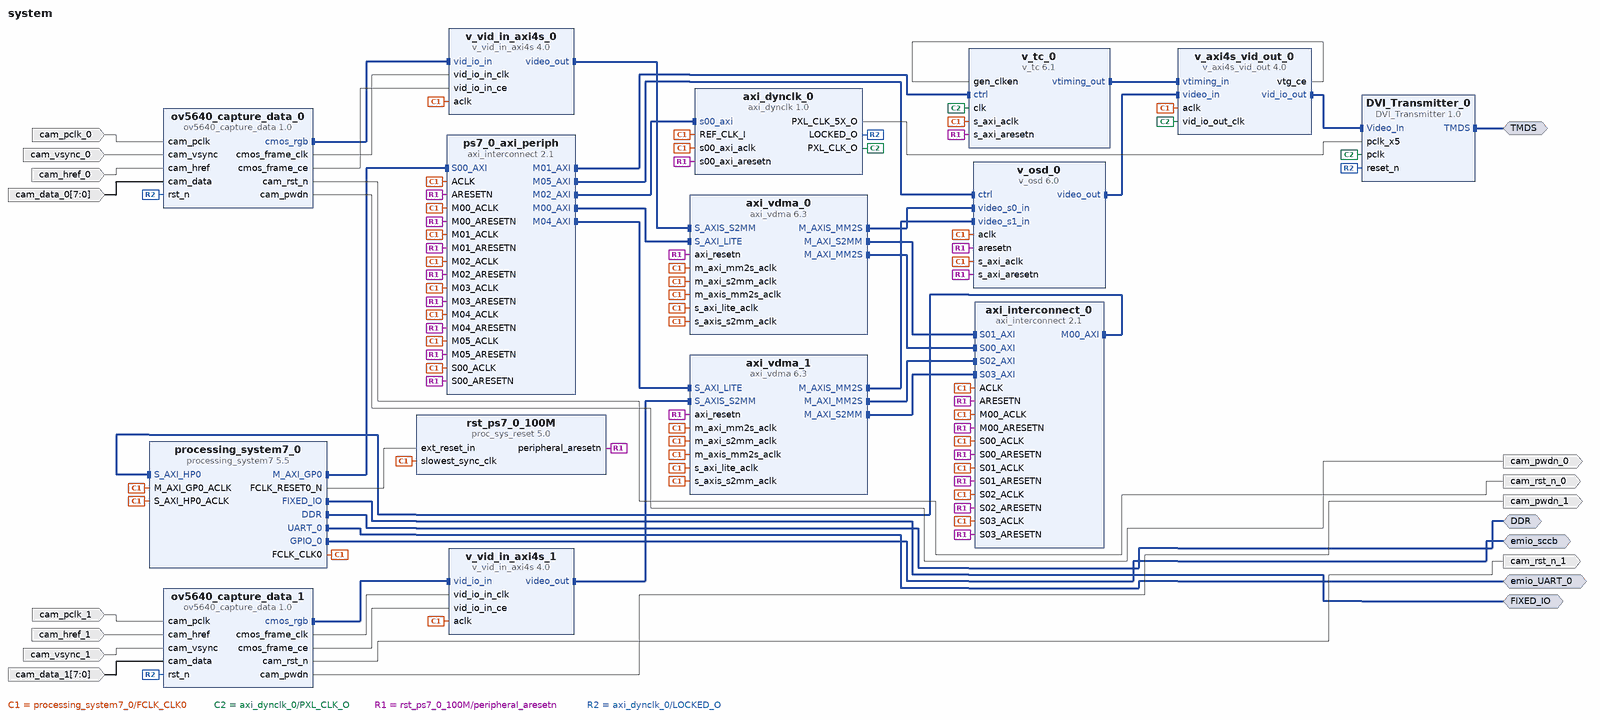
[diagram p0: block diagram of the top level]
# Vivado block design system, xc7z020clg400-2, Vivado 2018.3
create_bd_design system

create_bd_intf_port -mode Master -vlnv xilinx.com:interface:ddrx_rtl:1.0 DDR
create_bd_intf_port -mode Master -vlnv xilinx.com:display_processing_system7:fixedio_rtl:1.0 FIXED_IO
create_bd_intf_port -mode Master -vlnv xilinx.com:interface:gpio_rtl:1.0 emio_sccb
create_bd_intf_port -mode Master -vlnv openedv.com:user:TMDS_rtl:1.0 TMDS
create_bd_intf_port -mode Master -vlnv xilinx.com:interface:uart_rtl:1.0 emio_UART_0
create_bd_port -dir I cam_pclk_0
create_bd_port -dir I cam_vsync_0
create_bd_port -dir I cam_href_0
create_bd_port -dir I -from 7 -to 0 cam_data_0
create_bd_port -dir O -type rst cam_rst_n_0
create_bd_port -dir O cam_pwdn_0
create_bd_port -dir I cam_pclk_1
create_bd_port -dir I cam_href_1
create_bd_port -dir I cam_vsync_1
create_bd_port -dir I -from 7 -to 0 cam_data_1
create_bd_port -dir O -type rst cam_rst_n_1
create_bd_port -dir O cam_pwdn_1

create_bd_cell -type ip -vlnv xilinx.com:ip:processing_system7:5.5 processing_system7_0
set_property -dict [list \
  CONFIG.PCW_FPGA0_PERIPHERAL_FREQMHZ 100 \
  CONFIG.PCW_GPIO_EMIO_GPIO_ENABLE 1 \
  CONFIG.PCW_GPIO_EMIO_GPIO_IO 4 \
  CONFIG.PCW_GPIO_EMIO_GPIO_WIDTH 4 \
  CONFIG.PCW_PRESET_BANK1_VOLTAGE {LVCMOS 1.8V} \
  CONFIG.PCW_QSPI_GRP_SINGLE_SS_ENABLE 1 \
  CONFIG.PCW_QSPI_GRP_SINGLE_SS_IO {MIO 1 .. 6} \
  CONFIG.PCW_QSPI_PERIPHERAL_ENABLE 1 \
  CONFIG.PCW_QSPI_QSPI_IO {MIO 1 .. 6} \
  CONFIG.PCW_SD0_GRP_CD_ENABLE 1 \
  CONFIG.PCW_SD0_GRP_CD_IO {MIO 10} \
  CONFIG.PCW_SD0_GRP_WP_ENABLE 0 \
  CONFIG.PCW_SD0_PERIPHERAL_ENABLE 1 \
  CONFIG.PCW_SD0_SD0_IO {MIO 40 .. 45} \
  CONFIG.PCW_SDIO_PERIPHERAL_FREQMHZ 100 \
  CONFIG.PCW_SINGLE_QSPI_DATA_MODE x4 \
  CONFIG.PCW_UART0_PERIPHERAL_ENABLE 1 \
  CONFIG.PCW_UART0_UART0_IO EMIO \
  CONFIG.PCW_UART_PERIPHERAL_FREQMHZ 100 \
  CONFIG.PCW_UIPARAM_DDR_PARTNO {MT41J256M16 RE-125} \
  CONFIG.PCW_USE_S_AXI_HP0 1 \
] [get_bd_cells processing_system7_0]
# 86 more settings of processing_system7_0 are not shown: defaults, MIO pin electricals, DDR timing, and values the tool derives
create_bd_cell -type ip -vlnv xilinx.com:ip:axi_vdma:6.3 axi_vdma_0
set_property -dict [list \
  CONFIG.c_include_s2mm 1 \
  CONFIG.c_m_axis_mm2s_tdata_width 24 \
  CONFIG.c_mm2s_linebuffer_depth 2048 \
  CONFIG.c_mm2s_max_burst_length 64 \
  CONFIG.c_num_fstores 3 \
  CONFIG.c_s2mm_genlock_mode 2 \
  CONFIG.c_s2mm_linebuffer_depth 2048 \
  CONFIG.c_s2mm_max_burst_length 64 \
] [get_bd_cells axi_vdma_0]
create_bd_cell -type ip -vlnv xilinx.com:ip:v_tc:6.1 v_tc_0
set_property -dict {CONFIG.enable_detection false} [get_bd_cells v_tc_0]
create_bd_cell -type ip -vlnv xilinx.com:ip:v_axi4s_vid_out:4.0 v_axi4s_vid_out_0
set_property -dict {CONFIG.C_HAS_ASYNC_CLK 1} [get_bd_cells v_axi4s_vid_out_0]
create_bd_cell -type ip -vlnv digilentinc.com:ip:axi_dynclk:1.0 axi_dynclk_0
create_bd_cell -type ip -vlnv xilinx.com:ip:proc_sys_reset:5.0 rst_ps7_0_100M
create_bd_cell -type ip -vlnv xilinx.com:ip:axi_interconnect:2.1 ps7_0_axi_periph
set_property -dict {CONFIG.NUM_MI 6} [get_bd_cells ps7_0_axi_periph]
create_bd_cell -type ip -vlnv xilinx.com:ip:v_vid_in_axi4s:4.0 v_vid_in_axi4s_0
set_property -dict {CONFIG.C_HAS_ASYNC_CLK 1} [get_bd_cells v_vid_in_axi4s_0]
create_bd_cell -type ip -vlnv alientek.com:user:ov5640_capture_data:1.0 ov5640_capture_data_0
create_bd_cell -type ip -vlnv alientek.com:user:ov5640_capture_data:1.0 ov5640_capture_data_1
create_bd_cell -type ip -vlnv xilinx.com:ip:v_vid_in_axi4s:4.0 v_vid_in_axi4s_1
set_property -dict {CONFIG.C_HAS_ASYNC_CLK 1} [get_bd_cells v_vid_in_axi4s_1]
create_bd_cell -type ip -vlnv xilinx.com:ip:axi_vdma:6.3 axi_vdma_1
set_property -dict [list \
  CONFIG.c_m_axis_mm2s_tdata_width 24 \
  CONFIG.c_mm2s_linebuffer_depth 2048 \
  CONFIG.c_mm2s_max_burst_length 64 \
  CONFIG.c_s2mm_linebuffer_depth 2048 \
  CONFIG.c_s2mm_max_burst_length 64 \
] [get_bd_cells axi_vdma_1]
create_bd_cell -type ip -vlnv xilinx.com:ip:v_osd:6.0 v_osd_0
set_property -dict [list \
  CONFIG.BG_COLOR0 128 \
  CONFIG.BG_COLOR1 128 \
  CONFIG.BG_COLOR2 128 \
  CONFIG.Data_Channel_Width 8 \
  CONFIG.LAYER0_GLOBAL_ALPHA_VALUE 256 \
  CONFIG.LAYER0_HEIGHT 720 \
  CONFIG.LAYER0_HORIZONTAL_START_POSITION 0 \
  CONFIG.LAYER0_PRIORITY 0 \
  CONFIG.LAYER0_VERTICAL_START_POSITION 0 \
  CONFIG.LAYER0_WIDTH 1280 \
  CONFIG.LAYER1_GLOBAL_ALPHA_ENABLE true \
  CONFIG.LAYER1_GLOBAL_ALPHA_VALUE 256 \
  CONFIG.LAYER1_HEIGHT 720 \
  CONFIG.LAYER1_HORIZONTAL_START_POSITION 0 \
  CONFIG.LAYER1_PRIORITY 1 \
  CONFIG.LAYER1_VERTICAL_START_POSITION 0 \
  CONFIG.LAYER1_WIDTH 1280 \
  CONFIG.LAYER2_FONT_ASCII_OFFSET 0 \
  CONFIG.LAYER2_FONT_NUMBER_OF_CHARACTERS 128 \
  CONFIG.LAYER2_GLOBAL_ALPHA_ENABLE false \
  CONFIG.LAYER2_GLOBAL_ALPHA_VALUE 256 \
  CONFIG.LAYER2_HEIGHT 720 \
  CONFIG.LAYER2_HORIZONTAL_START_POSITION 0 \
  CONFIG.LAYER2_PRIORITY 2 \
  CONFIG.LAYER2_TYPE Internal_Graphics_Controller \
  CONFIG.LAYER2_VERTICAL_START_POSITION 0 \
  CONFIG.LAYER2_WIDTH 1280 \
  CONFIG.LAYER3_FONT_ASCII_OFFSET 0 \
  CONFIG.LAYER3_FONT_NUMBER_OF_CHARACTERS 128 \
  CONFIG.LAYER3_GLOBAL_ALPHA_ENABLE false \
  CONFIG.LAYER3_GLOBAL_ALPHA_VALUE 256 \
  CONFIG.LAYER3_HEIGHT 720 \
  CONFIG.LAYER3_HORIZONTAL_START_POSITION 0 \
  CONFIG.LAYER3_PRIORITY 3 \
  CONFIG.LAYER3_TYPE Internal_Graphics_Controller \
  CONFIG.LAYER3_VERTICAL_START_POSITION 0 \
  CONFIG.LAYER3_WIDTH 1280 \
  CONFIG.LAYER4_GLOBAL_ALPHA_ENABLE false \
  CONFIG.LAYER4_GLOBAL_ALPHA_VALUE 256 \
  CONFIG.LAYER4_HEIGHT 720 \
  CONFIG.LAYER4_HORIZONTAL_START_POSITION 0 \
  CONFIG.LAYER4_PRIORITY 3 \
  CONFIG.LAYER4_VERTICAL_START_POSITION 0 \
  CONFIG.LAYER4_WIDTH 1280 \
  CONFIG.LAYER5_GLOBAL_ALPHA_ENABLE false \
  CONFIG.LAYER5_GLOBAL_ALPHA_VALUE 256 \
  CONFIG.LAYER5_HEIGHT 720 \
  CONFIG.LAYER5_HORIZONTAL_START_POSITION 0 \
  CONFIG.LAYER5_PRIORITY 3 \
  CONFIG.LAYER5_VERTICAL_START_POSITION 0 \
  CONFIG.LAYER5_WIDTH 1280 \
  CONFIG.LAYER6_GLOBAL_ALPHA_ENABLE false \
  CONFIG.LAYER6_GLOBAL_ALPHA_VALUE 256 \
  CONFIG.LAYER6_HEIGHT 720 \
  CONFIG.LAYER6_HORIZONTAL_START_POSITION 0 \
  CONFIG.LAYER6_PRIORITY 3 \
  CONFIG.LAYER6_VERTICAL_START_POSITION 0 \
  CONFIG.LAYER6_WIDTH 1280 \
  CONFIG.LAYER7_GLOBAL_ALPHA_ENABLE false \
  CONFIG.LAYER7_GLOBAL_ALPHA_VALUE 256 \
  CONFIG.LAYER7_HEIGHT 720 \
  CONFIG.LAYER7_HORIZONTAL_START_POSITION 0 \
  CONFIG.LAYER7_PRIORITY 3 \
  CONFIG.LAYER7_VERTICAL_START_POSITION 0 \
  CONFIG.LAYER7_WIDTH 1280 \
  CONFIG.NUMBER_OF_LAYERS 4 \
  CONFIG.S_AXIS_VIDEO_FORMAT RGB \
] [get_bd_cells v_osd_0]
create_bd_cell -type ip -vlnv xilinx.com:ip:axi_interconnect:2.1 axi_interconnect_0
set_property -dict {CONFIG.NUM_MI 1 CONFIG.NUM_SI 4} [get_bd_cells axi_interconnect_0]
create_bd_cell -type ip -vlnv openedv.com:user:DVI_Transmitter:1.0 DVI_Transmitter_0

# ---- connections ----

connect_bd_intf_net [get_bd_intf_ports FIXED_IO] [get_bd_intf_pins processing_system7_0/FIXED_IO]
connect_bd_intf_net [get_bd_intf_pins ov5640_capture_data_1/cmos_rgb] [get_bd_intf_pins v_vid_in_axi4s_1/vid_io_in]
connect_bd_intf_net [get_bd_intf_ports DDR] [get_bd_intf_pins processing_system7_0/DDR]
connect_bd_intf_net [get_bd_intf_pins ps7_0_axi_periph/M01_AXI] [get_bd_intf_pins v_tc_0/ctrl]
connect_bd_intf_net [get_bd_intf_pins v_axi4s_vid_out_0/vtiming_in] [get_bd_intf_pins v_tc_0/vtiming_out]
connect_bd_intf_net [get_bd_intf_pins ps7_0_axi_periph/M00_AXI] [get_bd_intf_pins axi_vdma_0/S_AXI_LITE]
connect_bd_intf_net [get_bd_intf_pins ps7_0_axi_periph/M04_AXI] [get_bd_intf_pins axi_vdma_1/S_AXI_LITE]
connect_bd_intf_net [get_bd_intf_pins v_osd_0/video_s0_in] [get_bd_intf_pins axi_vdma_0/M_AXIS_MM2S]
connect_bd_intf_net [get_bd_intf_pins axi_vdma_1/M_AXIS_MM2S] [get_bd_intf_pins v_osd_0/video_s1_in]
connect_bd_intf_net [get_bd_intf_ports emio_UART_0] [get_bd_intf_pins processing_system7_0/UART_0]
connect_bd_intf_net [get_bd_intf_pins DVI_Transmitter_0/Video_In] [get_bd_intf_pins v_axi4s_vid_out_0/vid_io_out]
connect_bd_intf_net [get_bd_intf_ports emio_sccb] [get_bd_intf_pins processing_system7_0/GPIO_0]
connect_bd_intf_net [get_bd_intf_pins processing_system7_0/M_AXI_GP0] [get_bd_intf_pins ps7_0_axi_periph/S00_AXI]
connect_bd_intf_net [get_bd_intf_ports TMDS] [get_bd_intf_pins DVI_Transmitter_0/TMDS]
connect_bd_intf_net [get_bd_intf_pins ps7_0_axi_periph/M02_AXI] [get_bd_intf_pins axi_dynclk_0/s00_axi]
connect_bd_intf_net [get_bd_intf_pins ps7_0_axi_periph/M05_AXI] [get_bd_intf_pins v_osd_0/ctrl]
connect_bd_intf_net [get_bd_intf_pins axi_vdma_1/M_AXI_MM2S] [get_bd_intf_pins axi_interconnect_0/S02_AXI]
connect_bd_intf_net [get_bd_intf_pins v_vid_in_axi4s_0/video_out] [get_bd_intf_pins axi_vdma_0/S_AXIS_S2MM]
connect_bd_intf_net [get_bd_intf_pins v_osd_0/video_out] [get_bd_intf_pins v_axi4s_vid_out_0/video_in]
connect_bd_intf_net [get_bd_intf_pins axi_vdma_1/M_AXI_S2MM] [get_bd_intf_pins axi_interconnect_0/S03_AXI]
connect_bd_intf_net [get_bd_intf_pins axi_vdma_0/M_AXI_S2MM] [get_bd_intf_pins axi_interconnect_0/S01_AXI]
connect_bd_intf_net [get_bd_intf_pins ov5640_capture_data_0/cmos_rgb] [get_bd_intf_pins v_vid_in_axi4s_0/vid_io_in]
connect_bd_intf_net [get_bd_intf_pins axi_vdma_0/M_AXI_MM2S] [get_bd_intf_pins axi_interconnect_0/S00_AXI]
connect_bd_intf_net [get_bd_intf_pins v_vid_in_axi4s_1/video_out] [get_bd_intf_pins axi_vdma_1/S_AXIS_S2MM]
connect_bd_intf_net [get_bd_intf_pins axi_interconnect_0/M00_AXI] [get_bd_intf_pins processing_system7_0/S_AXI_HP0]
connect_bd_net [get_bd_pins processing_system7_0/FCLK_CLK0] \
  [get_bd_pins axi_vdma_0/s_axi_lite_aclk] [get_bd_pins axi_vdma_0/m_axi_mm2s_aclk] [get_bd_pins axi_vdma_0/m_axis_mm2s_aclk] \
  [get_bd_pins v_axi4s_vid_out_0/aclk] [get_bd_pins processing_system7_0/S_AXI_HP0_ACLK] \
  [get_bd_pins rst_ps7_0_100M/slowest_sync_clk] [get_bd_pins ps7_0_axi_periph/M00_ACLK] \
  [get_bd_pins processing_system7_0/M_AXI_GP0_ACLK] [get_bd_pins ps7_0_axi_periph/S00_ACLK] \
  [get_bd_pins ps7_0_axi_periph/ACLK] [get_bd_pins v_tc_0/s_axi_aclk] [get_bd_pins ps7_0_axi_periph/M01_ACLK] \
  [get_bd_pins axi_dynclk_0/s00_axi_aclk] [get_bd_pins ps7_0_axi_periph/M02_ACLK] [get_bd_pins axi_dynclk_0/REF_CLK_I] \
  [get_bd_pins ps7_0_axi_periph/M03_ACLK] [get_bd_pins axi_vdma_0/m_axi_s2mm_aclk] [get_bd_pins axi_vdma_0/s_axis_s2mm_aclk] \
  [get_bd_pins v_vid_in_axi4s_0/aclk] [get_bd_pins axi_interconnect_0/ACLK] [get_bd_pins axi_interconnect_0/S00_ACLK] \
  [get_bd_pins axi_interconnect_0/M00_ACLK] [get_bd_pins v_vid_in_axi4s_1/aclk] [get_bd_pins axi_vdma_1/s_axis_s2mm_aclk] \
  [get_bd_pins axi_vdma_1/s_axi_lite_aclk] [get_bd_pins ps7_0_axi_periph/M04_ACLK] [get_bd_pins axi_vdma_1/m_axis_mm2s_aclk] \
  [get_bd_pins axi_vdma_1/m_axi_s2mm_aclk] [get_bd_pins v_osd_0/aclk] [get_bd_pins v_osd_0/s_axi_aclk] \
  [get_bd_pins ps7_0_axi_periph/M05_ACLK] [get_bd_pins axi_interconnect_0/S01_ACLK] [get_bd_pins axi_vdma_1/m_axi_mm2s_aclk] \
  [get_bd_pins axi_interconnect_0/S02_ACLK] [get_bd_pins axi_interconnect_0/S03_ACLK]
connect_bd_net [get_bd_pins axi_dynclk_0/PXL_CLK_O] \
  [get_bd_pins v_tc_0/clk] [get_bd_pins v_axi4s_vid_out_0/vid_io_out_clk] [get_bd_pins DVI_Transmitter_0/pclk]
connect_bd_net [get_bd_pins processing_system7_0/FCLK_RESET0_N] [get_bd_pins rst_ps7_0_100M/ext_reset_in]
connect_bd_net [get_bd_pins rst_ps7_0_100M/peripheral_aresetn] \
  [get_bd_pins axi_vdma_0/axi_resetn] [get_bd_pins ps7_0_axi_periph/M00_ARESETN] [get_bd_pins ps7_0_axi_periph/S00_ARESETN] \
  [get_bd_pins ps7_0_axi_periph/ARESETN] [get_bd_pins v_tc_0/s_axi_aresetn] [get_bd_pins ps7_0_axi_periph/M01_ARESETN] \
  [get_bd_pins axi_dynclk_0/s00_axi_aresetn] [get_bd_pins ps7_0_axi_periph/M02_ARESETN] \
  [get_bd_pins ps7_0_axi_periph/M03_ARESETN] [get_bd_pins axi_interconnect_0/S00_ARESETN] \
  [get_bd_pins axi_interconnect_0/M00_ARESETN] [get_bd_pins axi_interconnect_0/ARESETN] [get_bd_pins axi_vdma_1/axi_resetn] \
  [get_bd_pins ps7_0_axi_periph/M04_ARESETN] [get_bd_pins v_osd_0/aresetn] [get_bd_pins v_osd_0/s_axi_aresetn] \
  [get_bd_pins ps7_0_axi_periph/M05_ARESETN] [get_bd_pins axi_interconnect_0/S01_ARESETN] \
  [get_bd_pins axi_interconnect_0/S02_ARESETN] [get_bd_pins axi_interconnect_0/S03_ARESETN]
connect_bd_net [get_bd_pins axi_dynclk_0/LOCKED_O] \
  [get_bd_pins ov5640_capture_data_0/rst_n] [get_bd_pins ov5640_capture_data_1/rst_n] [get_bd_pins DVI_Transmitter_0/reset_n]
connect_bd_net [get_bd_pins v_axi4s_vid_out_0/vtg_ce] [get_bd_pins v_tc_0/gen_clken]
connect_bd_net [get_bd_pins ov5640_capture_data_0/cmos_frame_clk] [get_bd_pins v_vid_in_axi4s_0/vid_io_in_clk]
connect_bd_net [get_bd_pins ov5640_capture_data_0/cmos_frame_ce] [get_bd_pins v_vid_in_axi4s_0/vid_io_in_ce]
connect_bd_net -net cam_pclk_0_1 [get_bd_ports cam_pclk_0] [get_bd_pins ov5640_capture_data_0/cam_pclk]
connect_bd_net -net cam_vsync_0_1 [get_bd_ports cam_vsync_0] [get_bd_pins ov5640_capture_data_0/cam_vsync]
connect_bd_net -net cam_href_0_1 [get_bd_ports cam_href_0] [get_bd_pins ov5640_capture_data_0/cam_href]
connect_bd_net -net cam_data_0_1 [get_bd_ports cam_data_0] [get_bd_pins ov5640_capture_data_0/cam_data]
connect_bd_net [get_bd_pins ov5640_capture_data_0/cam_rst_n] [get_bd_ports cam_rst_n_0]
connect_bd_net [get_bd_pins ov5640_capture_data_0/cam_pwdn] [get_bd_ports cam_pwdn_0]
connect_bd_net [get_bd_pins ov5640_capture_data_1/cmos_frame_clk] [get_bd_pins v_vid_in_axi4s_1/vid_io_in_clk]
connect_bd_net [get_bd_pins ov5640_capture_data_1/cmos_frame_ce] [get_bd_pins v_vid_in_axi4s_1/vid_io_in_ce]
connect_bd_net -net cam_pclk_1_1 [get_bd_ports cam_pclk_1] [get_bd_pins ov5640_capture_data_1/cam_pclk]
connect_bd_net -net cam_href_1_1 [get_bd_ports cam_href_1] [get_bd_pins ov5640_capture_data_1/cam_href]
connect_bd_net -net cam_vsync_1_1 [get_bd_ports cam_vsync_1] [get_bd_pins ov5640_capture_data_1/cam_vsync]
connect_bd_net -net cam_data_1_1 [get_bd_ports cam_data_1] [get_bd_pins ov5640_capture_data_1/cam_data]
connect_bd_net [get_bd_pins ov5640_capture_data_1/cam_rst_n] [get_bd_ports cam_rst_n_1]
connect_bd_net [get_bd_pins ov5640_capture_data_1/cam_pwdn] [get_bd_ports cam_pwdn_1]
connect_bd_net [get_bd_pins axi_dynclk_0/PXL_CLK_5X_O] [get_bd_pins DVI_Transmitter_0/pclk_x5]

# ---- address map ----
assign_bd_address -offset 0x00000000 -range 1G -target_address_space [get_bd_addr_spaces axi_vdma_0/Data_MM2S] [get_bd_addr_segs processing_system7_0/S_AXI_HP0/HP0_DDR_LOWOCM]
assign_bd_address -offset 0x00000000 -range 1G -target_address_space [get_bd_addr_spaces axi_vdma_0/Data_S2MM] [get_bd_addr_segs processing_system7_0/S_AXI_HP0/HP0_DDR_LOWOCM]
assign_bd_address -offset 0x00000000 -range 1G -target_address_space [get_bd_addr_spaces axi_vdma_1/Data_MM2S] [get_bd_addr_segs processing_system7_0/S_AXI_HP0/HP0_DDR_LOWOCM]
assign_bd_address -offset 0x00000000 -range 1G -target_address_space [get_bd_addr_spaces axi_vdma_1/Data_S2MM] [get_bd_addr_segs processing_system7_0/S_AXI_HP0/HP0_DDR_LOWOCM]
assign_bd_address -offset 0x43000000 -range 64K -target_address_space [get_bd_addr_spaces processing_system7_0/Data] [get_bd_addr_segs axi_vdma_0/S_AXI_LITE/Reg]
assign_bd_address -offset 0x43010000 -range 64K -target_address_space [get_bd_addr_spaces processing_system7_0/Data] [get_bd_addr_segs axi_vdma_1/S_AXI_LITE/Reg]
assign_bd_address -offset 0x43C00000 -range 64K -target_address_space [get_bd_addr_spaces processing_system7_0/Data] [get_bd_addr_segs v_tc_0/ctrl/Reg]
assign_bd_address -offset 0x43C10000 -range 64K -target_address_space [get_bd_addr_spaces processing_system7_0/Data] [get_bd_addr_segs axi_dynclk_0/s00_axi/reg0]
assign_bd_address -offset 0x43C20000 -range 64K -target_address_space [get_bd_addr_spaces processing_system7_0/Data] [get_bd_addr_segs v_osd_0/ctrl/Reg]

validate_bd_design
save_bd_design
